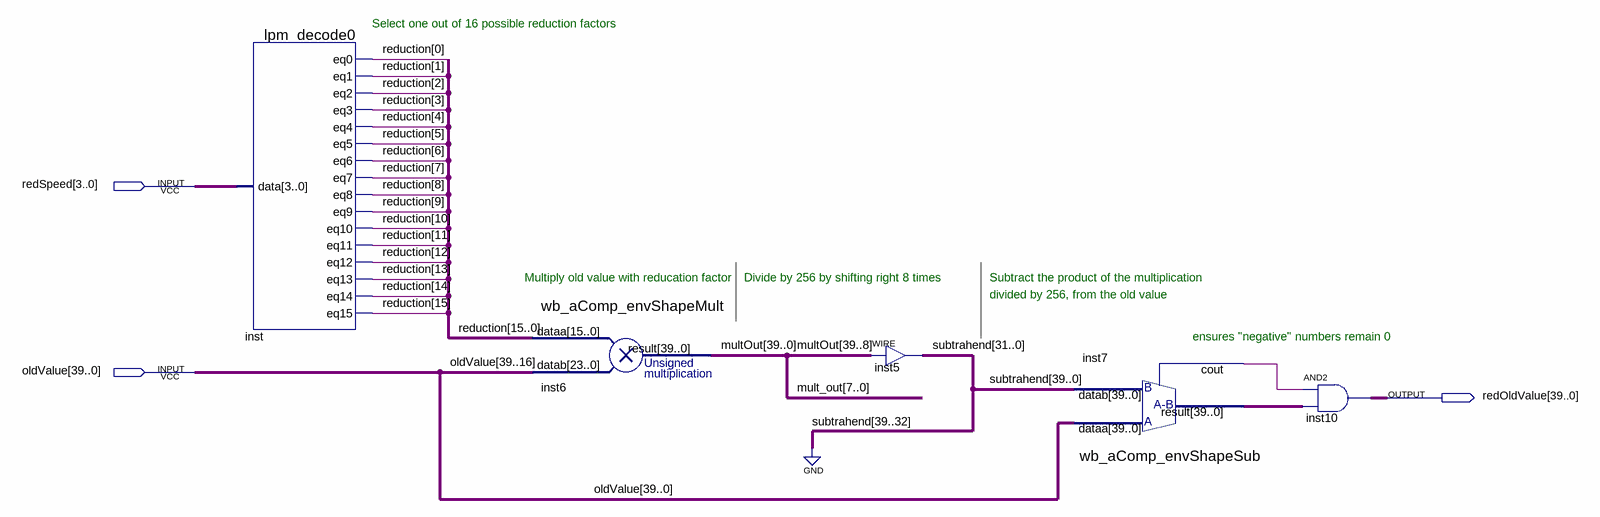
[diagram p0: schematic sheet]
// Quartus schematic wb_aComp_valueReducer.bdf as structural Verilog: 5 symbols, 3 pins
module wb_aComp_valueReducer (
  input  [3:0] redSpeed,
  input  [39:0] oldValue,
  output [39:0] redOldValue
);

  wire inst7_cout;
  wire [15:0] reduction;
  wire [31:0] subtrahend;
  wire [39:0] inst7_result, multOut;

  lpm_decode0 inst (
    .data(redSpeed), .eq0(reduction[0]), .eq1(reduction[1]), .eq2(reduction[2]), .eq3(reduction[3]),
    .eq4(reduction[4]), .eq5(reduction[5]), .eq6(reduction[6]), .eq7(reduction[7]), .eq8(reduction[8]),
    .eq9(reduction[9]), .eq10(reduction[10]), .eq11(reduction[11]), .eq12(reduction[12]),
    .eq13(reduction[13]), .eq14(reduction[14]), .eq15(reduction[15]));
  wb_aComp_envShapeMult inst6 (.dataa(reduction), .datab(oldValue[39:16]), .result(multOut));
  assign subtrahend = multOut[39:8];  // WIRE inst5
  wb_aComp_envShapeSub inst7 (
    .dataa(oldValue), .datab({{8{1'b0}}, subtrahend}), .result(inst7_result), .cout(inst7_cout));
  assign redOldValue = {40{inst7_cout}} & inst7_result;  // AND2 inst10, 40 bits wide

  // Notes on the sheet:
  //   Select one out of 16 possible reduction factors
  //   Multiply old value with reducation factor
  //   Divide by 256 by shifting right 8 times
  //   Subtract the product of the multiplication
  //   divided by 256, from the old value
  //   ensures "negative" numbers remain 0
endmodule
